# Altium schematic sheet Sheet1工程设计.SchDoc
size A4
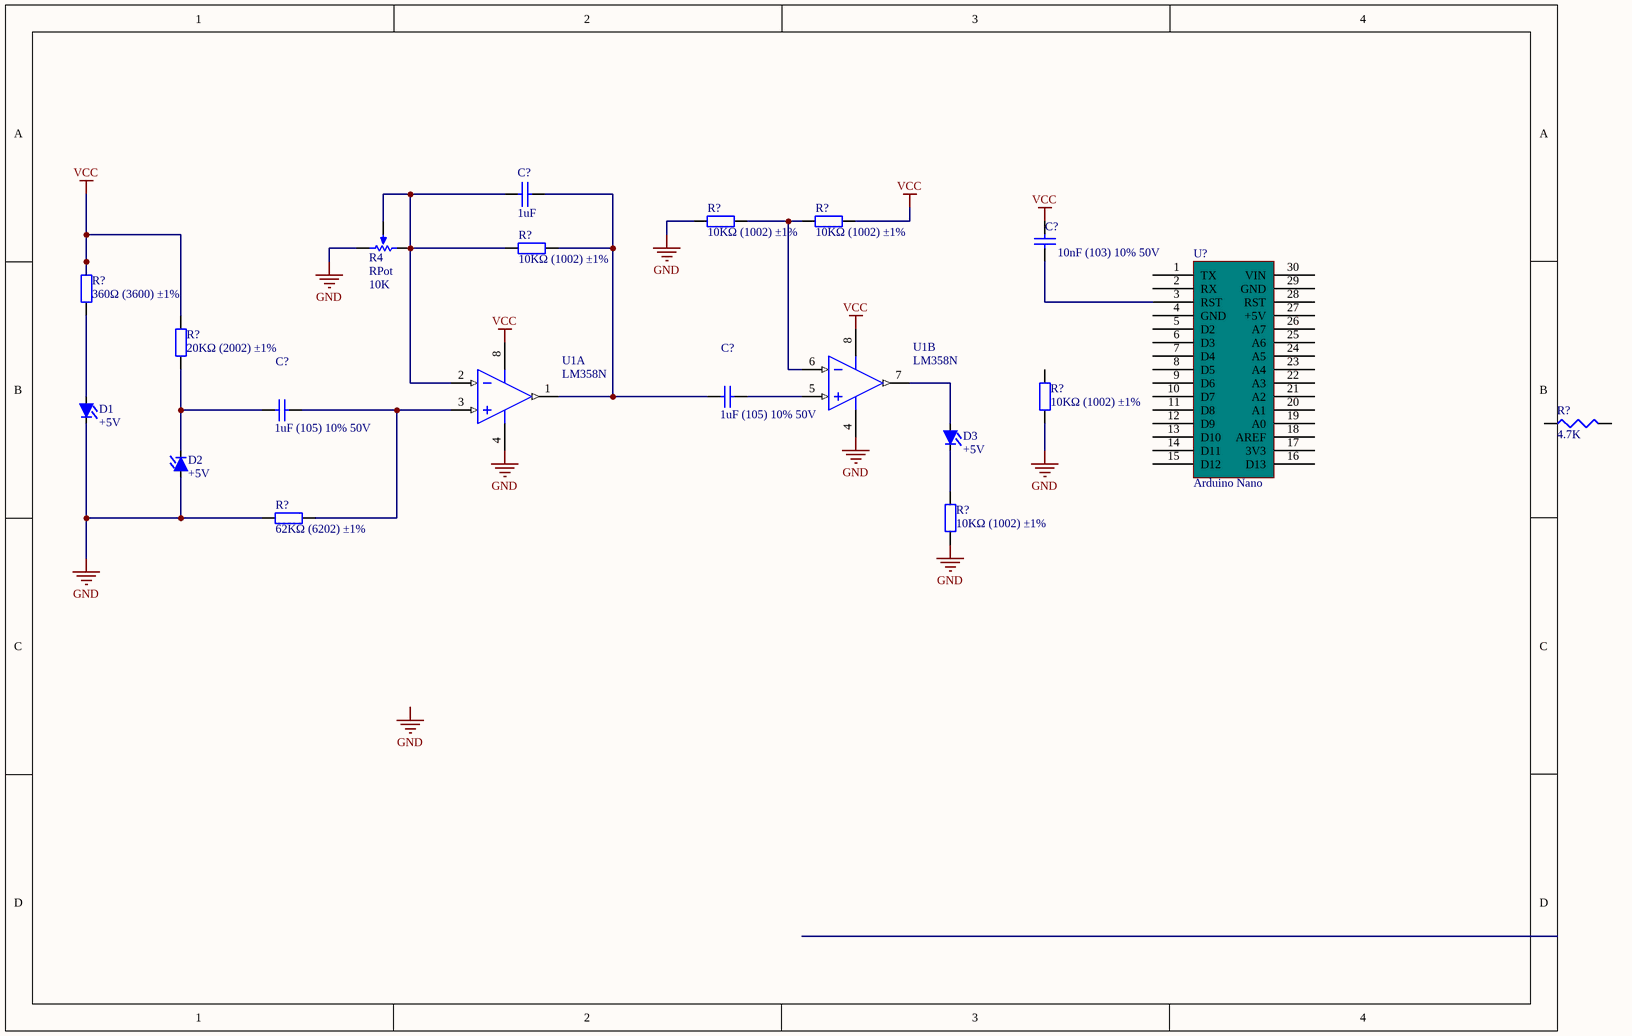
[diagram p0: Sheet1工程设计.SchDoc]

## Parts
(Parts that share a designator on the sheet are numbered #1, #2 ... from top to bottom, then left to right.)
C?#1  10nF (103) 10% 50V  [0805_C]
C?#2  1uF  [0805]
C?#3  1uF (105) 10% 50V  [0805_C]
C?#4  1uF (105) 10% 50V  [0805_C]
D1  +5V  [LED]
D2  +5V  [LED]
D3  +5V  [LED]
R4  RPot  value 10K  [VR5]
R?#1  10KΩ (1002) ±1%  [0805_R]
R?#2  10KΩ (1002) ±1%  [0805_R]
R?#3  10KΩ (1002) ±1%  [0805_R]
R?#4  360Ω (3600) ±1%  [0603_R]
R?#5  20KΩ (2002) ±1%  [0805_R]
R?#6  10KΩ (1002) ±1%  [0805_R]
R?#7  4.7K  [0805]
R?#8  62KΩ (6202) ±1%  [0805_R]
R?#9  10KΩ (1002) ±1%  [0805_R]
U1  LM358N  [N08E]  (parts A,B of 2)
U?  Arduino Nano  [PCBComponent_1]

## Nets
GND: D1.1 D2.2 R4.2(BOT) R?#1.1 R?#6.1 R?#8.1 R?#9.1 U1.4(GND)
VCC: C?#1.1 R?#2.2 R?#4.2 R?#5.2 U1.8(V+)
NetC?#1_2: C?#1.2 U?.3(RST)
NetC?#2_1: C?#2.1 C?#3.1 R?#3.2 U1.1(OUTA)
NetC?#2_2: C?#2.2 R4.1(TOP) R4.3(TAP) R?#3.1 U1.2(INA-)
NetC?#3_2: C?#3.2 U1.5(INB+)
NetC?#4_1: C?#4.1 D2.1 R?#5.1
NetC?#4_2: C?#4.2 R?#8.2 U1.3(INA+)
NetD1_2: D1.2 R?#4.1
NetD3_1: D3.1 R?#9.2
NetD3_2: D3.2 U1.7(OUTB)
NetR?#1_2: R?#1.2 R?#2.1 U1.6(INB-)

Not connected (* = marked no-connect by the designer): R?#6 2; R?#7 1 2; U? 1(TX) 2(RX) 4(GND) 5(D2) 6(D3) 7(D4) 8(D5) 9(D6) 10(D7) 11(D8) 12(D9) 13(D10) 14(D11) 15(D12) 16(D13) 17(3V3) 18(AREF) 19(A0) 20(A1) 21(A2) 22(A3) 23(A4) 24(A5) 25(A6) 26(A7) 27(+5V) 28(RST) 29(GND) 30(VIN)

## Notes on the sheet
- Labels drawn without touching a wire or pin: GND

## Library data of the parts
C?#1 = 0805 10nF (103) 10% 50V: 贴片电容; ComponentLink1Description: 供应商链接; ComponentLink1URL: http://www.szlcsc.com/product/details_2062.html; Package: 0805; Supplier: LC; SuppliersPartNumber: C1710
C?#2 = CAP
C?#3 C?#4 = 0805 1uF (105) 10% 50V: 贴片电容; ComponentLink1Description: 供应商链接; ComponentLink1URL: http://www.szlcsc.com/product/details_29074.html; Package: 0805; Supplier: LC; SuppliersPartNumber: C28323
D1-D3 = LED
R4 = RPot: Potentiometer; Sim Note: Enter the Resistance value and the set point into parameter fields.; Set Position: 0.5; Published: 8-Jun-2000; LatestRevisionDate: 17-Jul-2002; LatestRevisionNote: Re-released for DXP Platform.; PackageReference: VR5; Publisher: Altium Limited; PackageDescription: Variable Resistor, Thru-Hole; 3 Leads
R?#1-R?#3 R?#6 R?#9 = 0805 10KΩ (1002) 1%: 贴片电阻; ComponentLink1Description: 供应商链接; ComponentLink1URL: http://www.szlcsc.com/product/details_18102.html; Package: 0805; Supplier: LC; SuppliersPartNumber: C17414
R?#4 = 0603 360Ω (3600) 1%: 贴片电阻; ComponentLink1Description: 供应商链接; ComponentLink1URL: http://www.szlcsc.com/product/details_25937.html; Package: 0603; Supplier: LC; SuppliersPartNumber: C25194
R?#5 = 0805 20KΩ (2002) 1%: 贴片电阻; ComponentLink1Description: 供应商链接; ComponentLink1URL: http://www.szlcsc.com/product/details_4735.html; Package: 0805; Supplier: LC; SuppliersPartNumber: C4328
R?#7 = RES1
R?#8 = 0805 62KΩ (6202) 1%: 贴片电阻; ComponentLink1Description: 供应商链接; ComponentLink1URL: http://www.szlcsc.com/product/details_18471.html; Package: 0805; Supplier: LC; SuppliersPartNumber: C17783
U1 = LM358N: Low Power Dual Operational Amplifier; Manufacturer: National Semiconductor; CompType: Amplifiers; PackageTopMarking: NSUZXYTT*LM*358N; PowerWise: N; Published: 4-Dec-2008; LatestRevisionDate: 13-Jan-2009; LatestRevisionNote: Sim Model Added.; DatasheetVersion: Oct-2005; PackageVersion: revG, May-2006; PackageReference: N08E; Publisher: Altium Limited; PackageDescription: MDIP, .365 x .250 x .130in, 8 Lead, .100in Pitch; PartNumber: LM358N; RoHS: O; PinCount: 8; DigiKeyPartNumber: LM358NNS-ND; Code_JEDEC: MS-001-BA; ComponentLink1Description: LM358 Datasheet; ComponentLink1URL: http://www.national.com/ds/LM/LM358.pdf; ComponentLink2Description: LM358 Web Page; ComponentLink2URL: http://www.national.com/pf/LM/LM358.html; ComponentLink3Description: N08E Package Page; ComponentLink3URL: http://www.national.com/packaging/folders/n08e.html
U? = Component_1